# Altium schematic sheet main_controller.SchDoc
size A; SheetNumber: 3; SheetTotal: 4
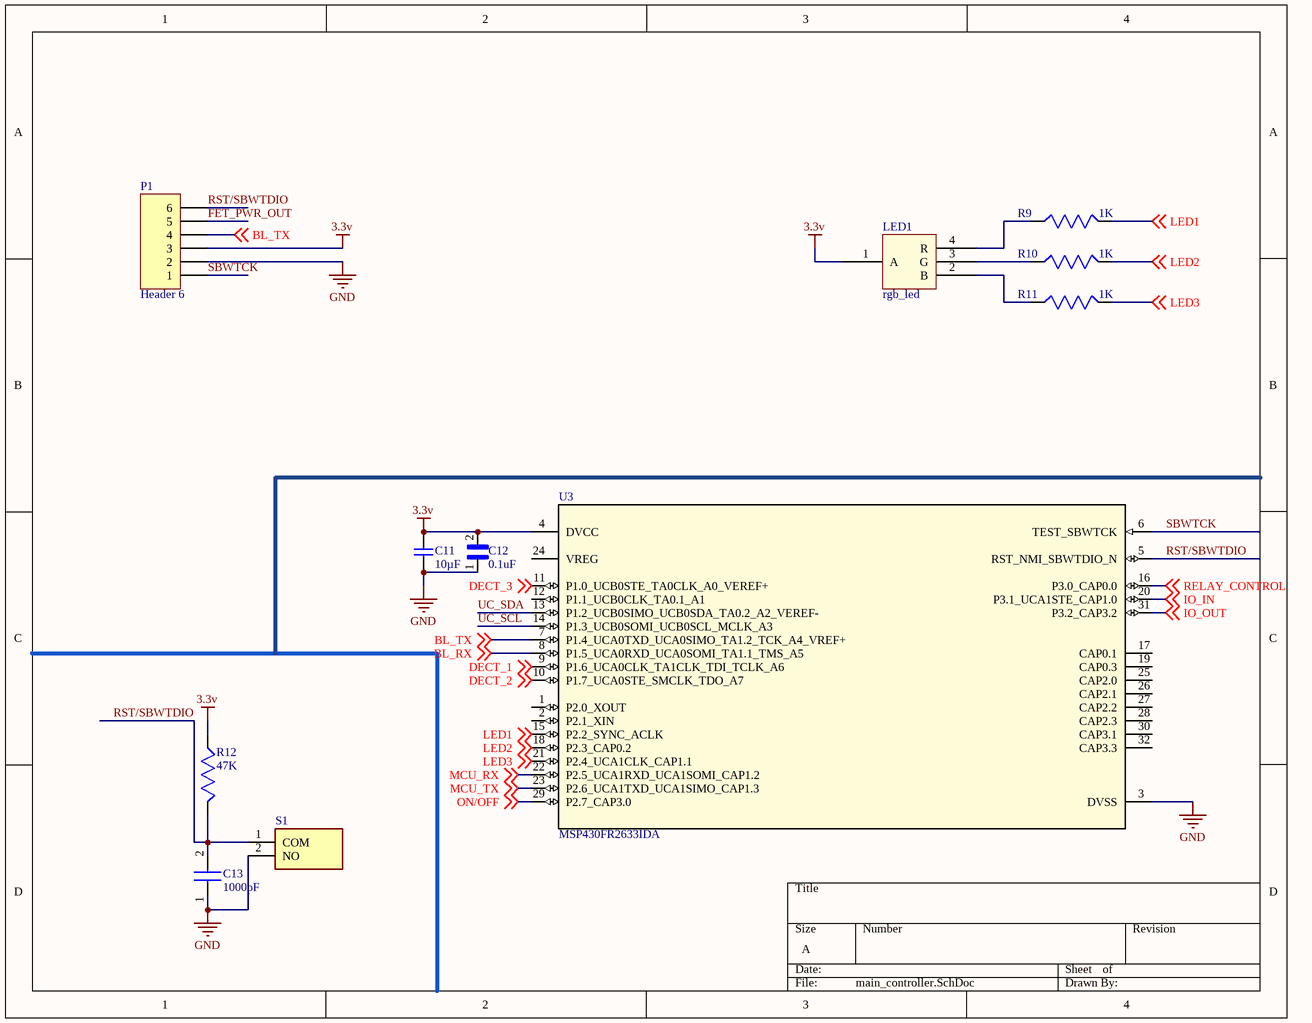
[diagram p0: main_controller.SchDoc]

## Parts
C11  10µF  [CAP_0603]
C12  value 0.1uF  [CAPC1608X90N]  (hidden comment: 06033G104ZAT4A)
C13  1000pF  [CAPC1608X90N]
LED1  rgb_led  [SOP4]
P1  Header 6  [HDR1X6]
R9  value 1K  [RESC1508X50N]  (hidden comment: RC0603FR-0747KL)
R10  value 1K  [RESC1508X50N]  (hidden comment: RC0603FR-0747KL)
R11  value 1K  [RESC1508X50N]  (hidden comment: RC0603FR-0747KL)
R12  value 47K  [RESC1608X55]  (hidden comment: RC0603FR-0747KL)
S1  PTS636_SM43_SMTR_LFS  [PTS636SM43SMTRLFS]  (value not drawn)
U3  MSP430FR2633IDA  [DA0032A_L]

## Nets
3.3v: C11.1 C12.2 LED1.1(A) P1.3 R12.2 U3.4(DVCC)
GND: C11.2 C12.1 C13.1 P1.2 S1.2(NO) U3.3(DVSS)
BL_RX: U3.8(P1.5_UCA0RXD_UCA0SOMI_TA1.1_TMS_A5) ; off-sheet BL_RX
BL_TX: P1.4 U3.7(P1.4_UCA0TXD_UCA0SIMO_TA1.2_TCK_A4_VREF+) ; off-sheet BL_TX
DECT_1: U3.9(P1.6_UCA0CLK_TA1CLK_TDI_TCLK_A6) ; off-sheet DECT_1
DECT_2: U3.10(P1.7_UCA0STE_SMCLK_TDO_A7) ; off-sheet DECT_2
DECT_3: U3.11(P1.0_UCB0STE_TA0CLK_A0_VEREF+) ; off-sheet DECT_3
FET_PWR_OUT: P1.5
IO_IN: U3.20(P3.1_UCA1STE_CAP1.0) ; off-sheet IO_IN
IO_OUT: U3.31(P3.2_CAP3.2) ; off-sheet IO_OUT
LED1: R9.1 U3.15(P2.2_SYNC_ACLK) ; off-sheet LED1
LED2: R10.1 U3.18(P2.3_CAP0.2) ; off-sheet LED2
LED3: R11.1 U3.21(P2.4_UCA1CLK_CAP1.1) ; off-sheet LED3
MCU_RX: U3.22(P2.5_UCA1RXD_UCA1SOMI_CAP1.2) ; off-sheet MCU_RX
MCU_TX: U3.23(P2.6_UCA1TXD_UCA1SIMO_CAP1.3) ; off-sheet MCU_TX
ON/OFF: U3.29(P2.7_CAP3.0) ; off-sheet ON/OFF
RELAY_CONTROL: U3.16(P3.0_CAP0.0) ; off-sheet RELAY_CONTROL
RST/SBWTDIO: C13.2 P1.6 R12.1 S1.1(COM) U3.5(RST_NMI_SBWTDIO_N)
SBWTCK: P1.1 U3.6(TEST_SBWTCK)
UC_SCL: U3.14(P1.3_UCB0SOMI_UCB0SCL_MCLK_A3)
UC_SDA: U3.13(P1.2_UCB0SIMO_UCB0SDA_TA0.2_A2_VEREF-)
NetLED1_2: LED1.2(B) R11.2
NetLED1_3: LED1.3(G) R10.2
NetLED1_4: LED1.4(R) R9.2

Not connected (* = marked no-connect by the designer): U3 1(P2.0_XOUT) 2(P2.1_XIN) 12(P1.1_UCB0CLK_TA0.1_A1) 17(CAP0.1) 19(CAP0.3) 24(VREG) 25(CAP2.0) 26(CAP2.1) 27(CAP2.2) 28(CAP2.3) 30(CAP3.1) 32(CAP3.3)

## Library data of the parts
C11 = CL10A106KP8NNNC: 10µF 10V Ceramic Capacitor X5R 0603 (1608 Metric) 0.063" L x 0.031" W (1.60mm x 0.80mm); Manufacturer: Samsung Electronics; Supplier 1: Digi-Key; Value: 10µF; Supplier Part Number 1: 1276-1192-1-ND; Part Number: CL10A106KP8NNNC
C12 = 06033G104ZAT4A: Cap Ceramic 0.1uF 25V Y5V -20% to 80% SMD 0603 85C T/R; MF: {'manufacturer': u'AVX'}; Availability: Unavailable; MP: 06033G104ZAT4A; Price: None; Package: None
C13 = 06035C102KAT4A: Capacitor; Manufacturer_Name: AVX; Datasheet Link: http://www.mouser.com/catalog/supplier/library/pdf/AVXSurfaceMountCeramic.pdf; Height: 0.9mm; Manufacturer_Part_Number: 06035C102KAT4A; Mouser Part Number: 581-06035C102KAT4A; Mouser Price/Stock: https://www.mouser.co.uk/ProductDetail/AVX/06035C102KAT4A?qs=ariCldvIWN%252BYB6jwt%252B7B2A%3D%3D; Arrow Part Number: 06035C102KAT4A; Arrow Price/Stock: https://www.arrow.com/en/products/06035c102kat4a/avx
P1 = Header 6: Header, 6-Pin; LatestRevisionDate: 17-Jul-2002; LatestRevisionNote: Re-released for DXP Platform.; Publisher: Altium Limited
R9-R12 = RC0603FR-0747KL: RC Series 0603 0.1 W 47 kOhms 1% Â±100 ppm/Â°C SMT Thick Film Chip Resistor; MF: {'manufacturer': u'Yageo'}; MP: RC0603FR-0747KL; Package: None; Price: None; Availability: Unavailable
S1 = PTS636_SM43_SMTR_LFS: Switch; Manufacturer_Name: C & K COMPONENTS; Manufacturer_Part_Number: PTS636 SM43 SMTR LFS; Datasheet Link: https://componentsearchengine.com/Datasheets/1/PTS636 SM43 SMTR LFS.pdf; Height: 4.5mm; Mouser Part Number: 611-PTS636SM43SMTRLF; Mouser Price/Stock: https://www.mouser.co.uk/ProductDetail/CK/PTS636-SM43-SMTR-LFS?qs=vLWxofP3U2xu5raMGkTmHg%3D%3D; Arrow Part Number: PTS636 SM43 SMTR LFS; Arrow Price/Stock: https://www.arrow.com/en/products/pts636-sm43-smtr-lfs/ck
U3 = MSP430FR2633IDA: No Description Available; Mfr_Name: Texas Instruments; PartNumber: MSP430FR2633IDAR; CompType: IC; Type: DEV; RefDes: RefDes; Copyright: Copyright (C) 2022 Ultra Librarian. All rights reserved.; Manufacturer_Part_Number: MSP430FR2633IDA; Application_BuildNumber: *; Alternate_PartNumber: MSP430FR2633IDA; PackageReference: DA0032A; MountType: SMT; Manufacturer: Texas Instruments